# Altium project 双红外反射传感器.PrjPCB
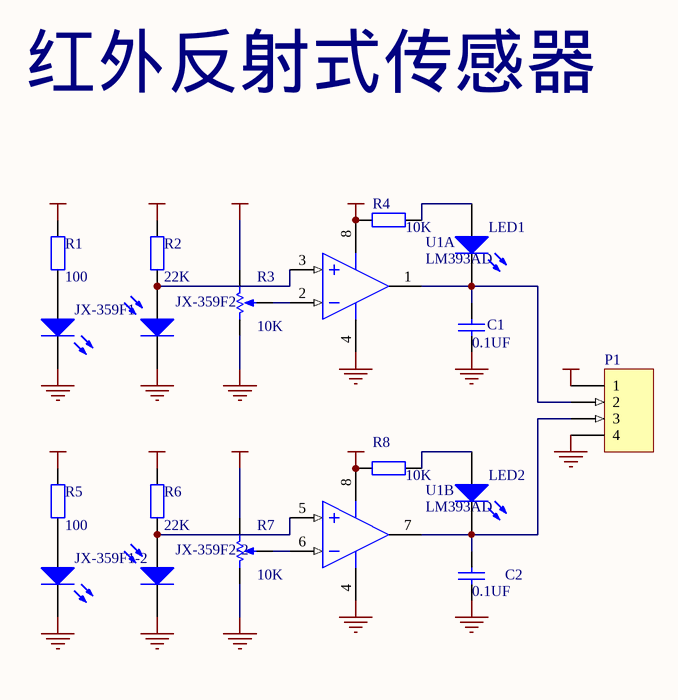
[diagram p0: 双红外反射传感器.SchDoc]
1 sheet, 18 parts. Net scope: global (net labels, ports and power ports of the same name join across sheets).
Board file: 双红外反射传感器.PcbDoc

## Sheet 双红外反射传感器.SchDoc
size A4

### Parts
C1  value 0.1UF  [C1608-0603]
C2  value 0.1UF  [C1608-0603]
JX-359F1  (no value)  [HDR1X2]
JX-359F1-2  (no value)  [HDR1X2]
JX-359F2  (no value)  [HDR1X2]
JX-359F2-2  (no value)  [HDR1X2]
LED1  (no value)  [HDR1X2]
LED2  (no value)  [HDR1X2]
P1  (no value)  [HDR1X4]
R1  value 100  [C1608-0603]
R2  value 22K  [C1608-0603]
R3  value 10K  [HDR1X3]
R4  value 10K  [C1608-0603]
R5  value 100  [C1608-0603]
R6  value 22K  [C1608-0603]
R7  value 10K  [HDR1X3]
R8  value 10K  [C1608-0603]
U1  LM393AD  [SO8]  (parts A,B of 2)

### Nets
GND: C1.1 C2.1 JX-359F1.2(K) JX-359F1-2.2(K) JX-359F2.2(K) JX-359F2-2.2(K) P1.4 R3.2(BOT) R7.2(BOT) U1.4(V+)
VCC: P1.1 R1.2 R2.2 R3.1(TOP) R4.2 R5.2 R6.2 R7.1(TOP) R8.2 U1.8(V-)
NetC1_2: C1.2 LED1.2(K) P1.2 U1.1(OUT)
NetC2_2: C2.2 LED2.2(K) P1.3 U1.7(OUT)
NetJX-359F1-2_1: JX-359F1-2.1(A) R5.1
NetJX-359F1_1: JX-359F1.1(A) R1.1
NetJX-359F2-2_1: JX-359F2-2.1(A) R6.1 U1.5(IN+)
NetJX-359F2_1: JX-359F2.1(A) R2.1 U1.3(IN+)
NetLED1_1: LED1.1(A) R4.1
NetLED2_1: LED2.1(A) R8.1
NetR3_3: R3.3(TAP) U1.2(IN-)
NetR7_3: R7.3(TAP) U1.6(IN-)

### Notes on the sheet
- 红外反射式传感器

### Library data of the parts
C1 C2 = Cap Semi: Capacitor (Semiconductor SIM Model); Published: 8-Jun-2000; LatestRevisionDate: 17-Jul-2002; LatestRevisionNote: Re-released for DXP Platform.; PackageReference: C1206; Publisher: Altium Limited
JX-359F1 JX-359F1-2 LED1 LED2 = LED3: Typical BLUE SiC LED; Published: 8-Jun-2000; LatestRevisionDate: 17-Dec-2003; LatestRevisionNote: PCB Footprint replaced.; Publisher: Altium Limited
JX-359F2 JX-359F2-2 = Photo Sen: Photosensitive Diode; Published: 24-Mar-1999; LatestRevisionDate: 17-Jul-2002; LatestRevisionNote: Re-released for DXP Platform.; Publisher: Altium Limited
P1 = Header 4: Header, 4-Pin; LatestRevisionDate: 17-Jul-2002; LatestRevisionNote: Re-released for DXP Platform.; Publisher: Altium Limited
R1 R2 R4-R6 R8 = Res2: Resistor; Published: 8-Jun-2000; LatestRevisionDate: 17-Jul-2002; LatestRevisionNote: Re-released for DXP Platform.; Publisher: Altium Limited
R3 R7 = RPot: Potentiometer; Sim Note: Enter the Resistance value and the set point into parameter fields.; Set Position: 0.5; Published: 8-Jun-2000; LatestRevisionDate: 17-Jul-2002; LatestRevisionNote: Re-released for DXP Platform.; Publisher: Altium Limited
U1 = LM393AD: Low-Power Dual Voltage Comparator; Published: 24-Aug-2001; LatestRevisionDate: 6-Jun-2005; LatestRevisionNote: Stylized 3D Model Added.; DatasheetDocument: Nov-1992; PackageDocument: Jul-1998; PackageReference: SO8; Publisher: Altium Limited; Code_JEDEC: MS-012-AA; Code_IPC: SO8; ComponentLink1Description: Manufacturer Link; ComponentLink1URL: http://www.st.com/